# Altium project board.PrjPcb
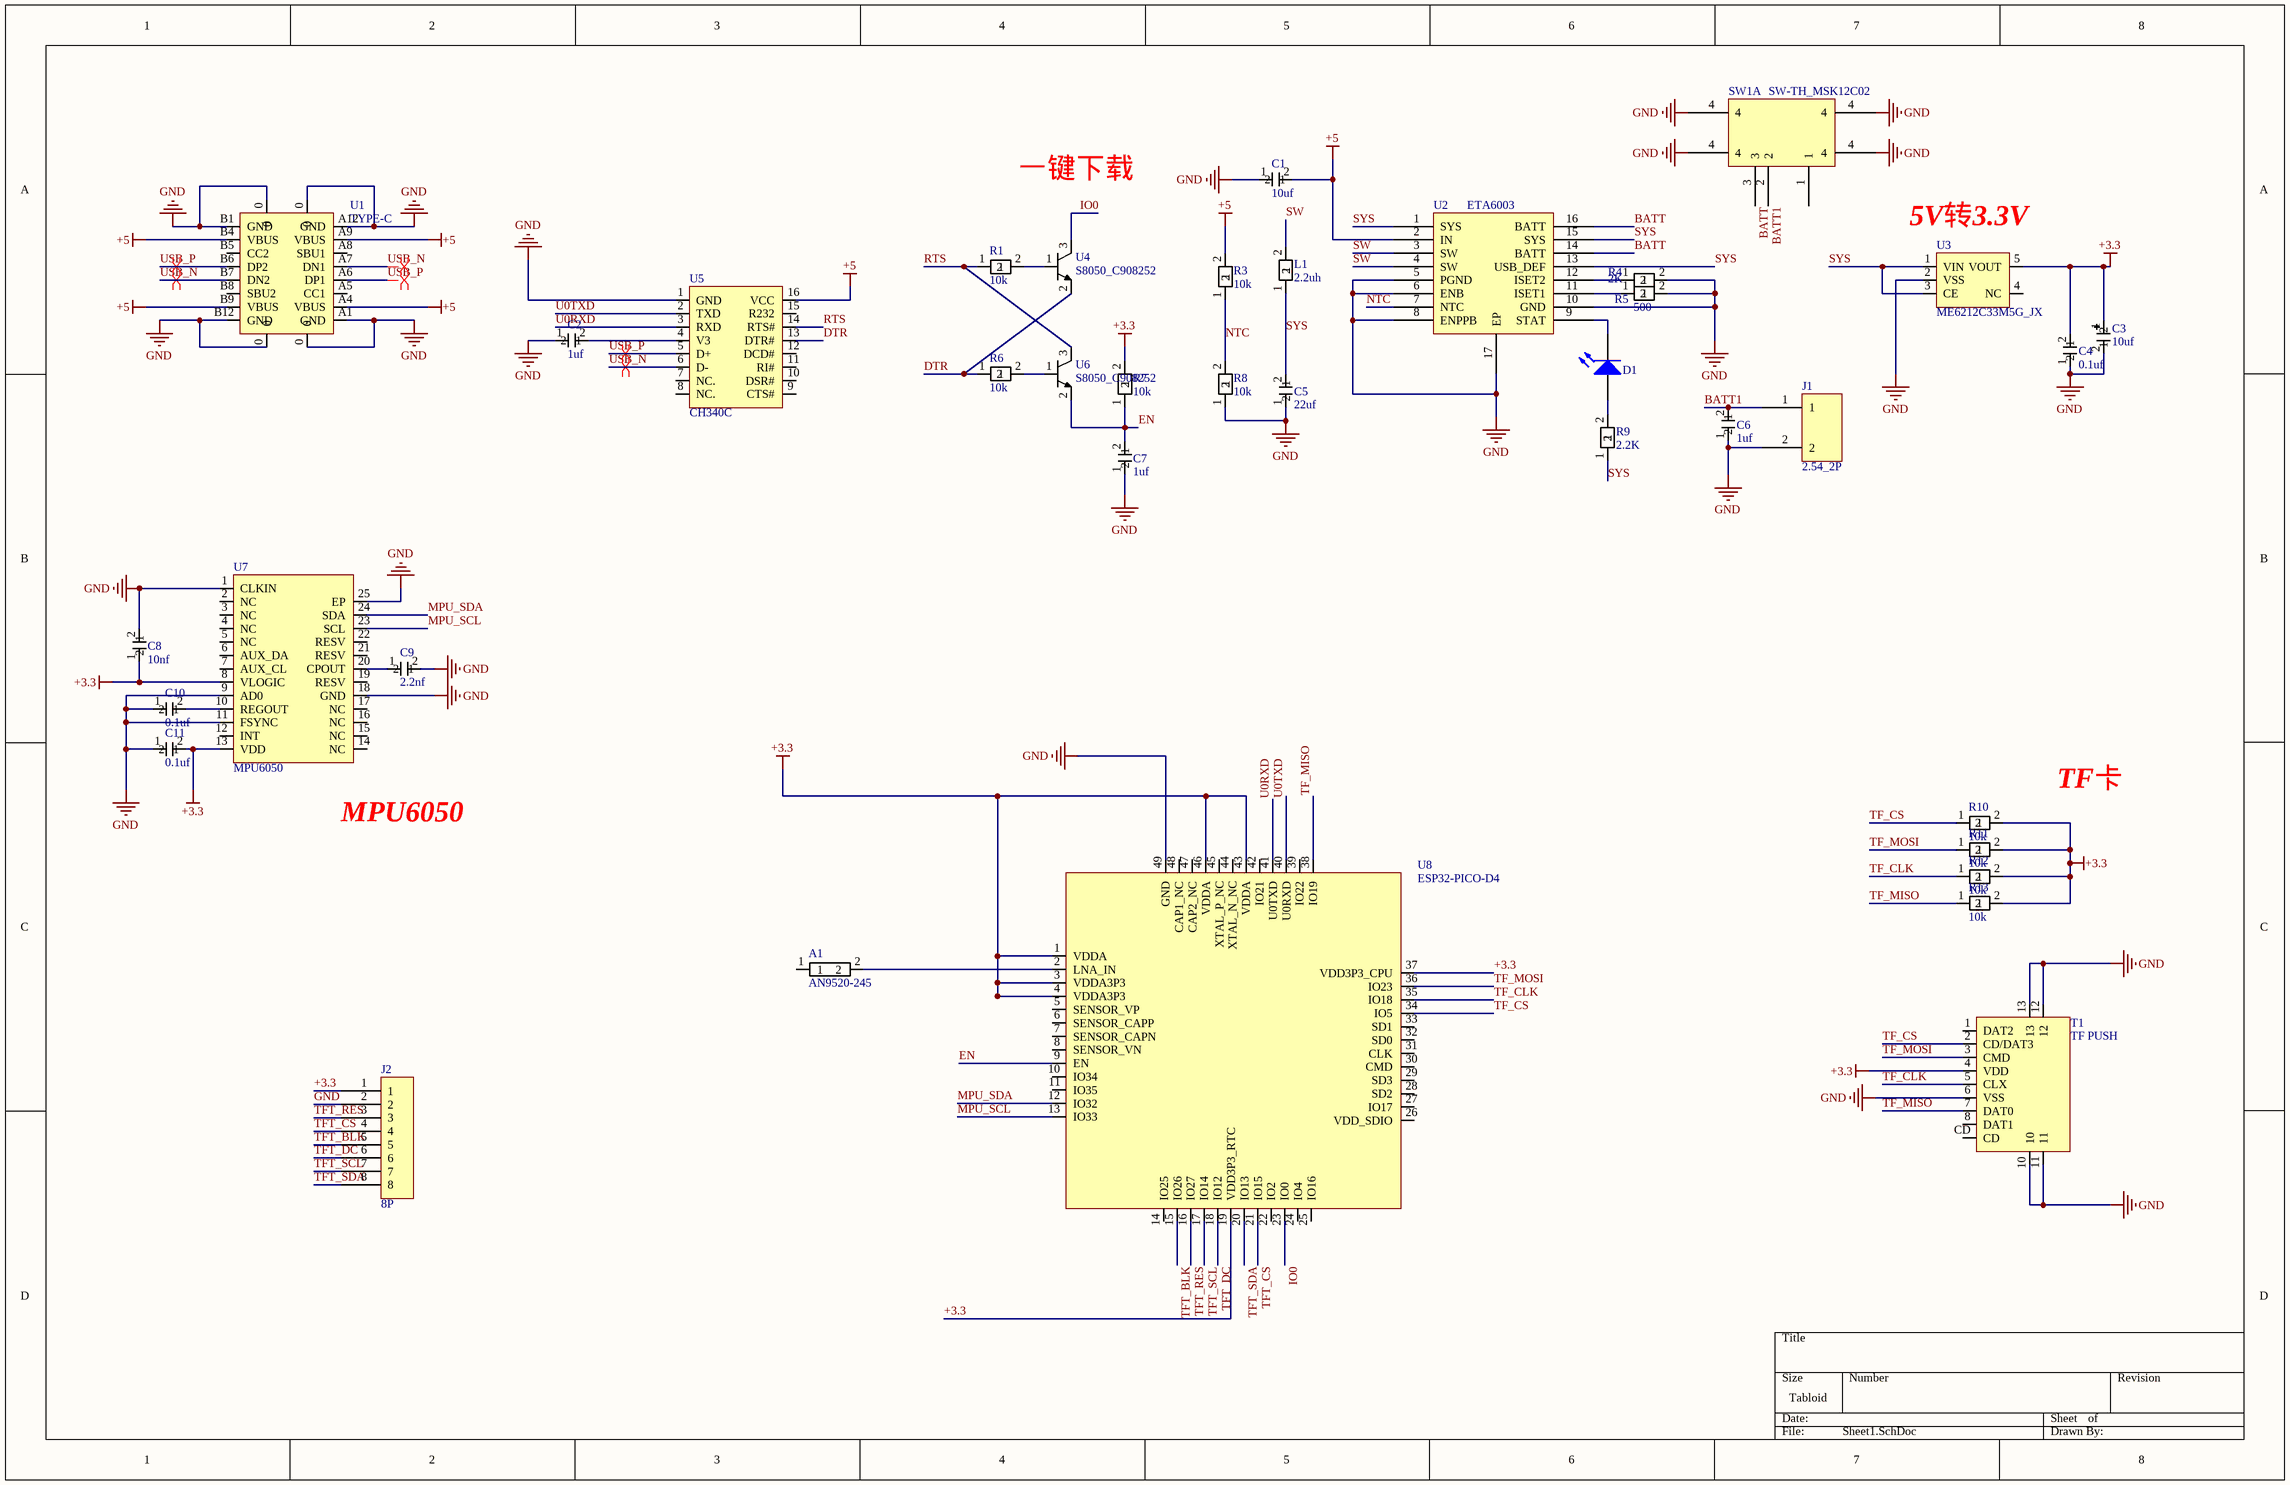
[diagram p0: Sheet1.SchDoc]
1 sheet, 38 parts. Net scope: global (net labels, ports and power ports of the same name join across sheets).
Board file: PCB1.PcbDoc

## Sheet Sheet1.SchDoc
size Tabloid

### Parts
A1  AN9520-245  [AN9520-245]
C1  10uf  [C0805]
C2  1uf  [C0805]
C3  10uf  [C+]
C4  0.1uf  [C0805]
C5  22uf  [C0805]
C6  1uf  [C0805]
C7  1uf  [C0805]
C8  10nf  [C0805]
C9  2.2nf  [C0805]
C10  0.1uf  [C0805]
C11  0.1uf  [C0805]
D1  LED 蓝 0805  [LED 蓝  0805]  (value not drawn)
J1  2.54_2P  [2P]
J2  8P  [8P-P2.54]
L1  2.2uh  [R0805]
R1  10k  [R0805]
R3  10k  [R0805]
R4  2K  [R0805]
R5  500  [R0805]
R6  10k  [R0805]
R7  10k  [R0805]
R8  10k  [R0805]
R9  2.2K  [R0805]
R10  10k  [R0805]
R11  10k  [R0805]
R12  10k  [R0805]
R13  10k  [R0805]
SW1  SW-TH_MSK12C02  [SW-TH_MSK12C02]  (part A of 3)
T1  TF PUSH  [TF-SMD_TF-PUSH]
U1  TYPE-C  [USB-C]
U2  ETA6003  [ETA6003]
U3  ME6212C33M5G_JX  [ME6212C33M5G_JX]
U4  S8050_C908252  [s8050]
U5  CH340C  [CH340C]
U6  S8050_C908252  [s8050]
U7  MPU6050  [MPU6050]
U8  ESP32-PICO-D4  [ESP32-PICO-D4]

### Nets
+3.3: C3.1 C4.2 C8.1 C11.2 J2.1 R7.2 R10.2 R11.2 R12.2 R13.2 T1.4(VDD) U3.5(VOUT) U7.8(VLOGIC) U7.13(VDD) U8.1(VDDA) U8.3(VDDA3P3) U8.4(VDDA3P3) U8.19(VDD3P3_RTC) U8.37(VDD3P3_CPU) U8.43(VDDA) U8.46(VDDA)
+5: C1.2 R3.2 U1.A4(VBUS) U1.A9(VBUS) U1.B4(VBUS) U1.B9(VBUS) U2.2(IN) U5.16(VCC)
GND: C1.1 C2.1 C3.2 C4.1 C5.1 C6.1 C7.1 C8.2 C9.2 C10.1 C11.1 J1.2 J2.2 R4.2 R5.2 R8.1 SW1.4 T1.6(VSS) T1.10 T1.11 T1.12 T1.13 U1.0 U1.A1(GND) U1.A12(GND) U1.B1(GND) U1.B12(GND) U2.5(PGND) U2.6(ENB) U2.8(ENPPB) U2.10(GND) U2.17(EP) U3.2(VSS) U5.1(GND) U7.1(CLKIN) U7.9(AD0) U7.11(FSYNC) U7.18(GND) U7.25(EP) U8.49(GND)
BATT: SW1.3 U2.14(BATT) U2.16(BATT)
BATT1: C6.2 J1.1 SW1.2
DTR: R6.1 U4.2(E) U5.13(DTR#)
EN: C7.2 R7.1 U6.2(E) U8.9(EN)
IO0: U4.3(C) U8.23(IO0)
MPU_SCL: U7.23(SCL) U8.13(IO33)
MPU_SDA: U7.24(SDA) U8.12(IO32)
NTC: R3.1 R8.2 U2.7(NTC)
RTS: R1.1 U5.14(RTS#) U6.3(C)
SW: L1.2 U2.3(SW) U2.4(SW)
SYS: C5.2 L1.1 R9.1 U2.1(SYS) U2.13(USB_DEF) U2.15(SYS) U3.1(VIN) U3.3(CE)
TF_CLK: R12.1 T1.5(CLX) U8.35(IO18)
TF_CS: R10.1 T1.2(CD/DAT3) U8.34(IO5)
TF_MISO: R13.1 T1.7(DAT0) U8.38(IO19)
TF_MOSI: R11.1 T1.3(CMD) U8.36(IO23)
TFT_BLK: J2.5 U8.15(IO26)
TFT_CS: J2.4 U8.21(IO15)
TFT_DC: J2.6 U8.18(IO12)
TFT_RES: J2.3 U8.16(IO27)
TFT_SCL: J2.7 U8.17(IO14)
TFT_SDA: J2.8 U8.20(IO13)
U0RXD: U5.3(RXD) U8.41(U0TXD)
U0TXD: U5.2(TXD) U8.40(U0RXD)
USB_N: U1.A7(DN1) U1.B7(DN2) U5.6(D-)
USB_P: U1.A6(DP1) U1.B6(DP2) U5.5(D+)
NetA1_2: A1.2 U8.2(LNA_IN)
NetC2_2: C2.2 U5.4(V3)
NetC9_1: C9.1 U7.20(CPOUT)
NetC10_2: C10.2 U7.10(REGOUT)
NetD1_1: D1.1(A) R9.2
NetD1_2: D1.2(K) U2.9(STAT)
NetR1_2: R1.2 U4.1(B)
NetR4_1: R4.1 U2.12(ISET2)
NetR5_1: R5.1 U2.11(ISET1)
NetR6_2: R6.2 U6.1(B)

Not connected (* = marked no-connect by the designer): A1 1; SW1 1; T1 1(DAT2) 8(DAT1) CD; U1 A5(CC1) A8(SBU1) B5(CC2) B8(SBU2); U3 4(NC); U5 7(NC.) 8(NC.) 9(CTS#) 10(DSR#) 11(RI#) 12(DCD#) 15(R232); U7 2(NC) 3(NC) 4(NC) 5(NC) 6(AUX_DA) 7(AUX_CL) 12(INT) 14(NC) 15(NC) 16(NC) 17(NC) 19(RESV) 21(RESV) 22(RESV); U8 5(SENSOR_VP) 6(SENSOR_CAPP) 7(SENSOR_CAPN) 8(SENSOR_VN) 10(IO34) 11(IO35) 14(IO25) 22(IO2) 24(IO4) 25(IO16) 26(VDD_SDIO) 27(IO17) 28(SD2) 29(SD3) 30(CMD) 31(CLK) 32(SD0) 33(SD1) 39(IO22) 42(IO21) 44(XTAL_N_NC) 45(XTAL_P_NC) 47(CAP2_NC) 48(CAP1_NC)

### Layout directives
differential pair: USB_N, USB_P

### Notes on the sheet
- 一键下载
- (near U3) 5V转3.3V
- (near U7) MPU6050
- TF卡

### Library data of the parts
C1 C2 C4-C11 = C0805
C3 = C+
L1 R1 R3-R13 = R0805
U1 = TYPE-C: TYPE-C-31-M-12
U4 U6 = s8050